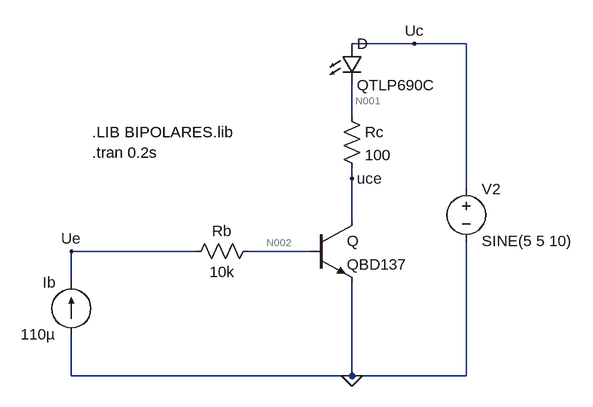
[diagram p0: schematic Draft2.asc]
Draft2.asc, the LTspice schematic file:
Version 4
SHEET 1 880 680
WIRE 272 32 176 32
WIRE 352 32 272 32
WIRE 176 144 176 96
WIRE 176 240 176 224
WIRE 352 256 352 32
WIRE 176 304 176 240
WIRE -64 352 -256 352
WIRE 112 352 16 352
WIRE -256 400 -256 352
WIRE -256 544 -256 480
WIRE 176 544 176 400
WIRE 176 544 -256 544
WIRE 352 544 352 336
WIRE 352 544 176 544
FLAG 176 544 0
FLAG 272 32 Uc
FLAG -256 352 Ue
FLAG 176 240 uce
SYMBOL LED 160 32 R0
SYMATTR InstName D
SYMATTR Value QTLP690C
SYMBOL res 160 128 R0
SYMATTR InstName Rc
SYMATTR Value 100
SYMBOL npn 112 304 R0
SYMATTR InstName Q
SYMATTR Value QBD137
SYMBOL res 32 336 R90
WINDOW 0 0 56 VBottom 2
WINDOW 3 32 56 VTop 2
SYMATTR InstName Rb
SYMATTR Value 10k
SYMBOL voltage 352 240 R0
WINDOW 123 0 0 Left 0
WINDOW 39 0 0 Left 0
SYMATTR InstName V2
SYMATTR Value SINE(5 5 10)
SYMBOL current -256 480 R180
WINDOW 0 24 80 Left 2
WINDOW 3 24 0 Left 2
WINDOW 123 0 0 Left 0
WINDOW 39 0 0 Left 0
SYMATTR InstName Ib
SYMATTR Value 110µ
TEXT -224 168 Left 2 !.LIB BIPOLARES.lib
TEXT -224 200 Left 2 !.tran 0.2s

The netlist it stands for:
* Draft2.asc
D Uc N001 QTLP690C
Rc N001 uce 100
Q uce N002 0 0 QBD137
Rb N002 Ue 10k
V2 Uc 0 SINE(5 5 10)
Ib 0 Ue 110µ
.model D D
.lib standard.dio
.model NPN NPN
.model PNP PNP
.lib standard.bjt
.LIB BIPOLARES.lib
.tran 0.2s
.backanno
.end

* Results of the author's LTspice run, read from the files saved beside the schematic
* Operating Point, zero values left out:
*   V(uc) = 5 V
*   V(n001) = 3.151 V
*   V(uce) = 2.133 V
*   V(n002) = 358 mV
*   V(ue) = 1.458 V
*   Ic(Q) = 10.19 mA
*   Ib(Q) = 110 µA
*   Ie(Q) = -10.3 mA
*   I(D) = 10.19 mA
*   I(Ib) = 110 µA
*   I(Rb) = -110 µA
*   I(Rc) = 10.19 mA
*   I(V2) = -10.19 mA
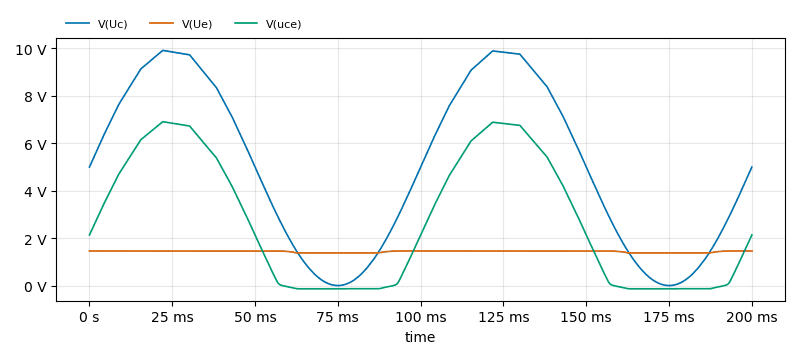
[diagram p1: Transient Analysis of Draft2.asc, plotted from the saved traces]
* Transient Analysis, 1 run:
*   V(Uc): min 44.08 µV, max 9.919 V, average 4.974 V, rms 6.095 V, last 5 V
*   V(Ue): min 1.375 V, max 1.458 V, average 1.434 V, rms 1.435 V, last 1.458 V
*   V(uce): min -136.8 mV, max 6.912 V, average 2.7 V, rms 3.847 V, last 2.133 V